# EAGLE design motor_drive_basic (EAGLE 8.6.2)
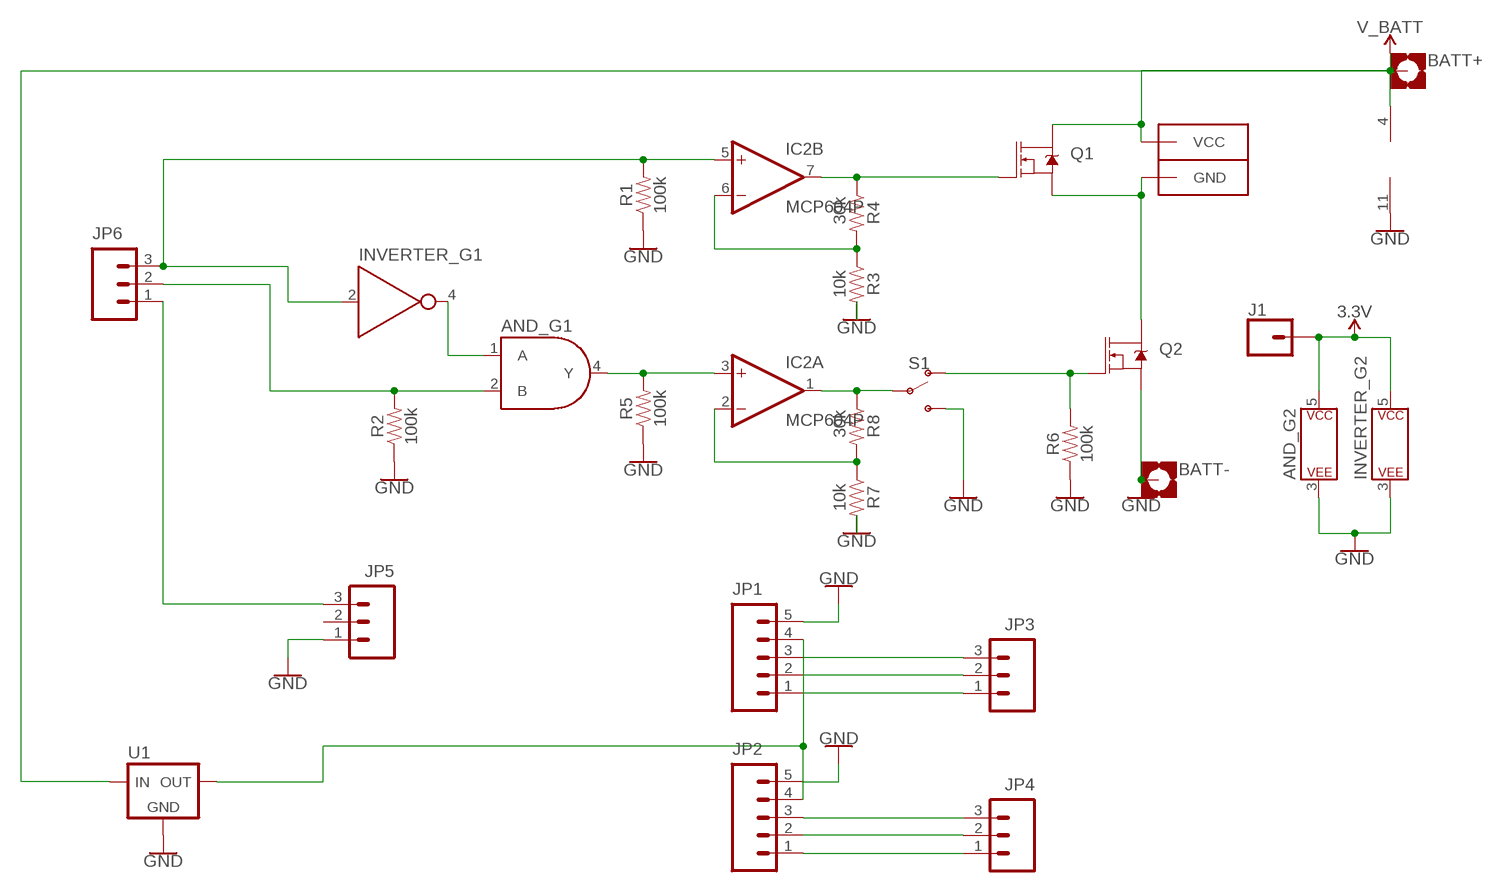
[diagram p0: schematic, sheet 1]

## Parts
AND_  74LVC08SE  [SOT23-5]
BATT+  MOUNT-PAD-SQUARE3.0  [3,0-PAD-SQUARE]
BATT-  MOUNT-PAD-SQUARE3.0  [3,0-PAD-SQUARE]
CONN1  ANDERSON_PP_DOUBLEVERTICAL  [ANDERSON_PP_DOUB_VERT]
IC2  MCP604P  [DIL14]
INVERTER_  74HC1G04  [SOT353]
J1  CONN_01  [1X01]
JP1  M05PTH  [1X05]
JP2  M05PTH  [1X05]
JP3  M03PTH  [1X03]
JP4  M03PTH  [1X03]
JP5  M03PTH  [1X03]
JP6  M03PTH  [1X03]
Q1  MOSFET-NCH-FQP30N06L  [TO220V]
Q2  MOSFET-NCH-FQP30N06L  [TO220V]
R1  100k  10KOHM-HORIZ-1/4W-1%  [AXIAL-0.3]
R2  100k  10KOHM-HORIZ-1/4W-1%  [AXIAL-0.3]
R3  10k  10KOHM-HORIZ-1/4W-1%  [AXIAL-0.3]
R4  30k  RESISTORAXIAL-0.3  [AXIAL-0.3]
R5  100k  10KOHM-HORIZ-1/4W-1%  [AXIAL-0.3]
R6  100k  10KOHM-HORIZ-1/4W-1%  [AXIAL-0.3]
R7  10k  10KOHM-HORIZ-1/4W-1%  [AXIAL-0.3]
R8  30k  RESISTORAXIAL-0.3  [AXIAL-0.3]
S1  SWITCH-SPDT-PTH-11.6X4.0MM-KIT  [SWITCH_SPDT_PTH_11.6X4.0MM_KIT]
U1  78XX-TO220V  [TO220BV]

## Nets
3.3V: AND_.5(P$V+) INVERTER_.5(P$V+) J1.1
GND: AND_.3(P$V-) BATT-.B3,0(MOUNT) IC2.11(P:V-) INVERTER_.3(P$V-) JP1.5 JP2.5 JP5.1 Q2.3(S) R1.P$1 R2.P$1 R3.P$2 R5.P$1 R6.P$1 R7.P$2 S1.3(S) U1.2(GND)
N$1: IC2.6(B:-IN) R3.P$1 R4.P$2
N$2: IC2.7(B:OUT) Q1.1(G) R4.P$1
N$3: IC2.2(A:-IN) R7.P$1 R8.P$2
N$4: AND_.4(Y) IC2.3(A:+IN) R5.P$2
N$5: Q2.1(G) R6.P$2 S1.1(O)
N$6: CONN1.PIN1(GND) Q1.3(S) Q2.2(D)
N$7: IC2.1(A:OUT) R8.P$1 S1.2(P)
N$8: AND_.1(A) INVERTER_.4(Y)
N$9: JP2.1 JP4.1
N$10: JP2.2 JP4.2
N$11: JP2.3 JP4.3
N$12: JP1.1 JP3.1
N$13: JP1.2 JP3.2
N$14: JP1.3 JP3.3
N$15: JP5.3 JP6.1
N$16: IC2.5(B:+IN) INVERTER_.2(A) JP6.3 R1.P$2
N$17: AND_.2(B) JP6.2 R2.P$2
N$18: JP1.4 JP2.4 U1.3(VOUT)
V_BATT: BATT+.B3,0(MOUNT) CONN1.PIN2(VCC) IC2.4(P:V+) Q1.2(D) U1.1(VIN)
Unconnected: IC2.8(C:OUT) IC2.9(C:-IN) IC2.10(C:+IN) IC2.12(D:+IN) IC2.13(D:-IN) IC2.14(D:OUT) JP5.2

## Library data of the parts
AND_ = SparkFun-IC-Logic:74*08: Single AND gate IC GATE AND SNGL 2INPUT SOT353 SparkFun Products SparkFun LogicBlocks Kit <https://www.sparkfun.com/products/11006> (KIT-11006) SparkFun RedBot Mainboard <https://www.sparkfun.com/products/12097> (ROB-12097); PROD_ID: IC-10841; VALUE: 74LVC1G08SE
BATT+ BATT- = holes:MOUNT-PAD-SQUARE: MOUNTING PAD, square
CONN1 = ee192:ANDERSON_PP_DOUBLE: 2-pin 25A Anderson Connector http://www.alliedelec.com/images/products/datasheets/bm/ANDERSON_POWER_PRODUCTS/70162018.pdf; PIE-INT-REF-NUM: Anderson
IC2 = linear:MCP604: Quad Op Amp 2.7V to 6.0V Single Supply CMOS Source: http://ww1.microchip.com/downloads/en/DeviceDoc/21314g.pdf
INVERTER_ = SparkFun-IC-Logic:74*1G04: Single Inverter IC NOT GATE INVERTER SNGL 1IN SOT353 Supply: 1.65V to 5.5V Datasheet <http://diodes.com/datasheets/74LVC1G04.pdf> SparkFun Products SparkFun Stepoko <https://www.sparkfun.com/products/13899> (ROB-13899) SparkFun CryptoShield <https://www.sparkfun.com/products/13183> (DEV-13183) SparkFun LogicBlocks Kit <https://www.sparkfun.com/products/11006> (KIT-11006) SparkFun ArduMoto <https://www.sparkfun.com/products/9815> (DEV-09815); PROD_ID: COMP-08268; VALUE: 74HC1G04
J1 = SparkFun-Connectors:CONN_01: Single connection point. Often used as Generic Header-pin footprint for 0.1 inch spaced/style header connections On any of the 0.1 inch spaced packages, you can populate with these: Break Away Headers - Straight <https://www.sparkfun.com/products/116> (PRT-00116) Break Away Male Headers - Right Angle <https://www.sparkfun.com/products/553> (PRT-00553) Female Headers <https://www.sparkfun.com/products/115> (PRT-00115) Break Away Headers - Machine Pin <https://www.sparkfun.com/products/117> (PRT-00117) Break Away Female Headers - Swiss Machine Pin <https://www.sparkfun.com/products/743> (PRT-00743) This device is also useful as a general connection point to wire up your design to another part of your project. Our various solder wires solder well into these plated through hole pads. Hook-Up Wire - Assortment (Stranded, 22 AWG) <https://www.sparkfun.com/products/11375> (PRT-11375) Hook-Up Wire - Assortment (Solid Core, 22 AWG) <https://www.sparkfun.com/products/11367> (PRT-11367) View the entire wire category on our website here <https://www.sparkfun.com/categories/141> Special notes: SMTSO-256-ET is a "flush mount" nut for a 4-40 screw. We mostly use this on specialty testbeds; it is a nice way to connect hardware to your PCB at an adjustable hieght. Also note, the SNAP packages are for using a snappable style connector. We sell a baggie of snaps and they are also used on two LilyPad designs: Snap Assortment - 30 pack (male and female) <https://www.sparkfun.com/products/11347> (DEV-11347) LilyPad Arduino SimpleSnap <https://www.sparkfun.com/products/10941> (DEV-10941) LilyPad SimpleSnap Protoboard <https://www.sparkfun.com/products/10940> (DEV-10940)
JP1 JP2 = ee192:M05: 5-pin 0.1-inch header and MTA connector Courtsey of Pioneers in Engineering; PIE-INT-REF-NUM: BULK-STOCK
JP3-JP6 = ee192:M03: 3-pin 0.1-inch header and MTA connector Courtsey of Pioneers in Engineering; PIE-INT-REF-NUM: BULK-STOCK
Q1 Q2 = SparkFun-DiscreteSemi:MOSFET-NCH: N-channel MOSFETs Voltage controlled devices that allow control of high current outputs. SparkFun Products: SparkFun OpenScale <https://www.sparkfun.com/products/13261> SparkFun Digital Sandbox <https://www.sparkfun.com/products/12651> SparkFun Monster Moto Shield <https://www.sparkfun.com/products/10182> SparkFun MOSFET Power Controller <https://www.sparkfun.com/products/11214>; PROD_ID: TRANS-10060; VALUE: 60V/32A/35mΩ
R1 R2 R5 R6 = SparkFun-Resistors:10KOHM: 10kΩ resistor A resistor is a passive two-terminal electrical component that implements electrical resistance as a circuit element. Resistors act to reduce current flow, and, at the same time, act to lower voltage levels within circuits. - Wikipedia; PROD_ID: RES-12183; VALUE: 10k
R3 R7 = SparkFun-Resistors:10KOHM: 10kΩ resistor A resistor is a passive two-terminal electrical component that implements electrical resistance as a circuit element. Resistors act to reduce current flow, and, at the same time, act to lower voltage levels within circuits. - Wikipedia; PROD_ID: RES-12183
R4 R8 = SparkFun-Resistors:RESISTOR: Generic Resistor Package
S1 = SparkFun-Switches:SWITCH-SPDT: Single Pole, Double Throw (SPDT) Switch Single-pole, double-throw (SPDT) switch. Variant Overview SMD-AYZ0202 Surface Mount DPDT Switch <https://www.sparkfun.com/products/597> (COM-00597) Used on e.g. LilyPad Arduino USB - ATmega32U4 Board <https://www.sparkfun.com/products/12049> PTH-11.6X4.0MM SPDT Mini Power Switch <https://www.sparkfun.com/products/102> (COM-00102) Used on e.g. SparkFun Simon Says - Through-Hole Soldering Kit <https://www.sparkfun.com/products/10547> (KIT-10547) PTH-11.6X4.0MM-KIT KIT version of SPDT Mini Power Switch - Simplifies soldering by removing tStop of switch pins - only one side can be soldered. PTH-11.6X4.0MM-LOCK LOCK version of SPDT Mini Power Switch - Offset pins hold switch in place for easier soldering. SMD-RIGHT-ANGLE Surface Mount Right Angle Switch <https://www.sparkfun.com/products/10860> (COM-10860) Used on e.g. SparkFun ESP8266 Thing <https://www.sparkfun.com/products/13231>; PROD_ID: SWCH-08261; SF_SKU: COM-00102
U1 = bt_regulator:78XX: 78XX Linear Voltage Regulator The venerable 7800-series Linear Voltage Regulator, including 7805, 7809, 7812, 7815, 7862 in 5 V, 6.2 V, 8.2 V, 9 V, 12 V, and 15 V, respectively Datasheets TI_LM78L05.pdf <http://www.ti.com/lit/ds/symlink/lm78l05.pdf> Fairchild_LM7805.pdf <https://www.fairchildsemi.com/datasheets/LM/LM7805.pdf>

## Board
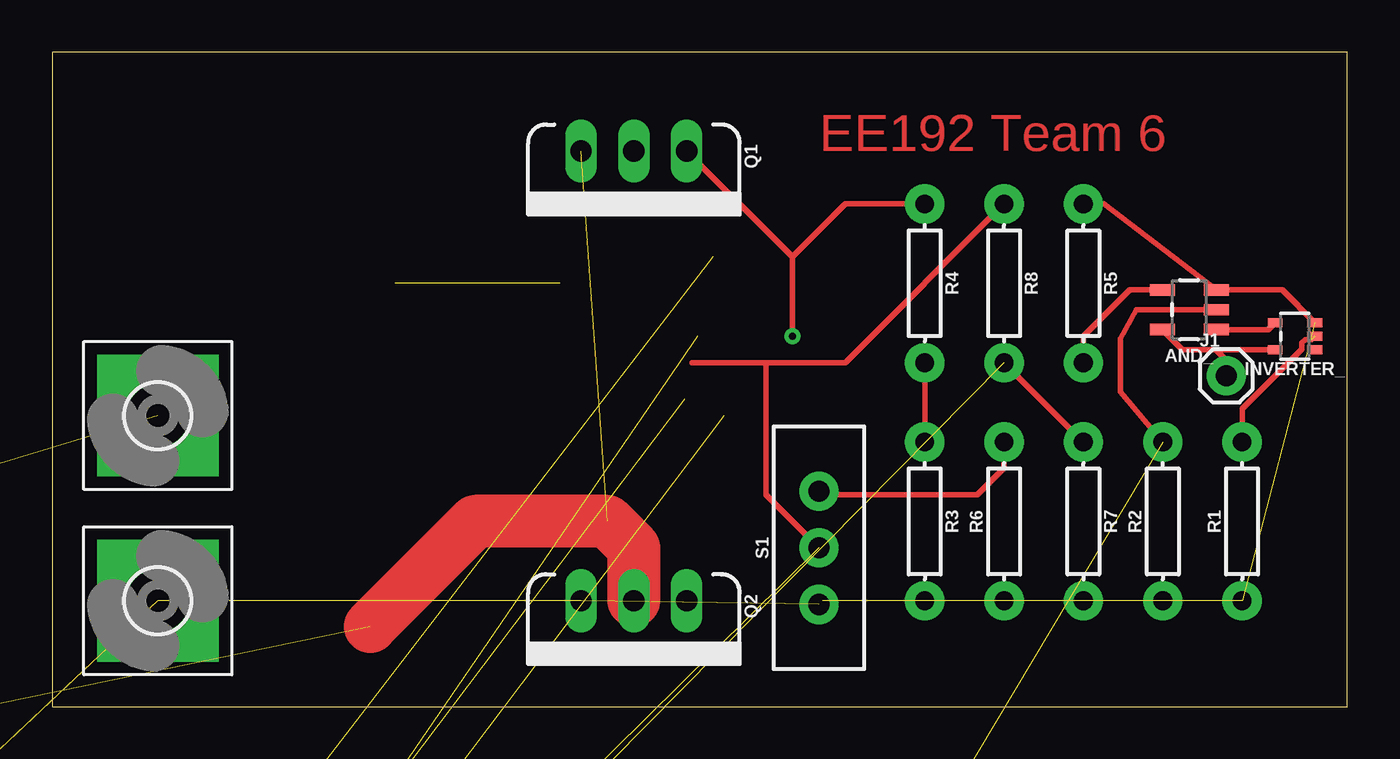
[diagram p1: board, top side]
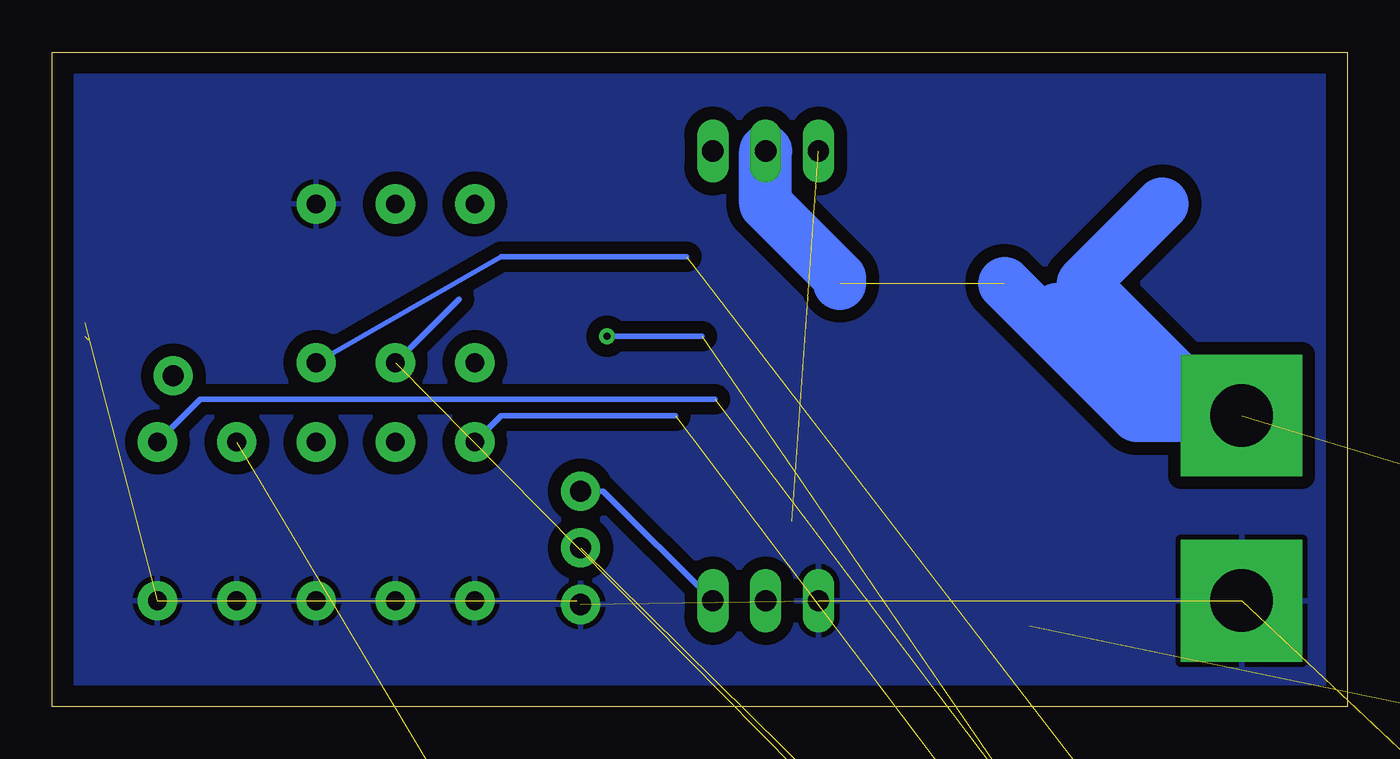
[diagram p2: board, bottom side, seen from below]

Size 62.21 x 31.42 mm. Coordinates in mm from the lower left corner, seen from the top.
Outline: 0,0 62.21,0 62.21,31.42 0,31.42 0,0
Copper layers (1*16): Top 0.035mm / dielectric 1.5mm / Bottom 0.035mm
Design rules "default": minimum track width 6mil, minimum drill 0.35mm, track to track 6mil, track to pad 6mil, pad to pad 6mil, via to via 6mil, smd to smd 6mil, copper to edge 40mil, drill to drill 6mil, minimum pad ring 10mil, minimum via ring 8mil, stop-mask expansion 4mil, vias tented up to drill 0mil, thermal gap 10mil

### Footprints (pad centres in the part's own frame; a part is rotated, then mirrored left to right if it is on the bottom)
SOT23-5 = smd 0.55 x 1.2: 1 -0.95,-1.3; 2 0,-1.3; 3 0.95,-1.3; 4 0.95,1.3; 5 -0.95,1.3
3,0-PAD-SQUARE = drill 3 pad 5.842 square: B3,0 0,0
ANDERSON_PP_DOUB_VERT = drill 1.778 pad 3.175: PIN1 0,-3.937; PIN2 0,3.937
DIL14 = drill 0.813 long: 1 -7.62,-3.81; 2 -5.08,-3.81; 3 -2.54,-3.81; 4 0,-3.81; 5 2.54,-3.81; 6 5.08,-3.81; 7 7.62,-3.81; 8 7.62,3.81; 9 5.08,3.81; 10 2.54,3.81; 11 0,3.81; 12 -2.54,3.81; 13 -5.08,3.81; 14 -7.62,3.81
SOT353 = smd 0.42 x 0.7: 1 -0.65,-0.95; 2 0,-0.95; 3 0.65,-0.95; 4 0.65,0.95; 5 -0.65,0.95
1X01 = drill 1.016 pad 1.88: 1 0,0
1X05 = drill 1.016 pad 1.88: 1 -5.08,0; 2 -2.54,0; 3 0,0; 4 2.54,0; 5 5.08,0
1X03 = drill 1.016 pad 1.88: 1 -2.54,0; 2 0,0; 3 2.54,0
TO220V = drill 1.016 long: 1 -2.54,0; 2 0,0; 3 2.54,0
AXIAL-0.3 = drill 0.9 pad 1.88: P$1 -3.81,0; P$2 3.81,0
SWITCH_SPDT_PTH_11.6X4.0MM_KIT = drill 1.016 pad 1.88: 1 0,2.718; 2 0,0; 3 0,-2.718
TO220BV = drill 1.016 long: 1 -2.54,0; 2 0,0; 3 2.54,0

### Placement (x,y rotation side)
AND_  54.61,19.05 90 top
BATT+  5.08,13.97 0 top
BATT-  5.08,5.08 0 top
CONN1  -40.64,-3.81 0 top  (outside the outline)
IC2  -41.91,-73.66 0 top  (outside the outline)
INVERTER_  59.69,17.78 90 top
J1  56.39,15.88 0 top
JP1  -41.91,-34.29 0 top  (outside the outline)
JP2  -41.91,-53.34 0 top  (outside the outline)
JP3  -44.45,-93.98 0 top  (outside the outline)
JP4  -44.45,-113.03 0 top  (outside the outline)
JP5  -44.45,-132.08 0 top  (outside the outline)
JP6  -44.45,-151.13 0 top  (outside the outline)
Q1  27.94,26.67 180 top
Q2  27.94,5.08 180 top
R1  57.15,8.89 90 top
R2  53.34,8.89 90 top
R3  41.91,8.89 270 top
R4  41.91,20.32 270 top
R5  49.53,20.32 270 top
R6  45.72,8.89 90 top
R7  49.53,8.89 270 top
R8  45.72,20.32 270 top
S1  36.83,7.62 0 top
U1  -45.72,-168.91 0 top  (outside the outline)

### Tracks (layer width: path | path; a pad name or v marks a point on that pad's centre or on a via)
3.3V
  Top 0.254: AND_.5 54.28,17.13 55.88,17.13 | 55.88,17.13 INVERTER_.5 | J1.1 56.39,16.62 55.88,17.13
GND  (13 unrouted)
  Top 0.254: INVERTER_.3 59.07,20 AND_.3 50.51,24.13 R5.P$1
  Bottom 0.254: S1.3 37.01,5.08
  pour Bottom (isolate 0.61): 0,31.75 0,0 62.23,0 62.23,31.75
N$1  (1 unrouted)
  Top 0.254: R4.P$2 R3.P$1
  Bottom 0.254: R3.P$1 40.64,13.97 32.26,13.97
N$2  (via drill 0.35)  (1 unrouted)
  Top 0.254: 35.56,21.59 Q1.1 | v35.56,17.78 35.56,21.59 | R4.P$1 38.1,24.13 35.56,21.59
  Bottom 0.254: 30.99,17.78 v35.56,17.78
N$3  (1 unrouted)
  Top 0.254: R7.P$1 R8.P$2
  Bottom 0.254: 42.67,19.56 R8.P$2
N$4  (1 unrouted)
  Top 0.254: R5.P$2 49.53,17.78 51.75,20 AND_.4
  Bottom 0.254: R5.P$2 40.64,21.59 31.75,21.59
N$5
  Top 0.254: R6.P$2 45.72,11.43 44.45,10.16 37.01,10.16 S1.1
  Bottom 0.254: Q2.1 35.74,10.34 S1.1
N$6  (2 unrouted)
  Top 2.54: 15.28,3.85 20.32,8.89 26.67,8.89 27.94,7.62 Q2.2
N$7  (1 unrouted)
  Top 0.254: R8.P$1 38.1,16.51 34.29,16.51 | 30.73,16.51 34.29,16.51 | S1.2 34.29,10.16 34.29,16.51
N$8
  Top 0.254: AND_.1 58.41,18.1 INVERTER_.4
N$9  (1 unrouted)
N$10  (1 unrouted)
N$11  (1 unrouted)
N$12  (1 unrouted)
N$13  (1 unrouted)
N$14  (1 unrouted)
N$15  (1 unrouted)
N$16  (3 unrouted)
  Top 0.254: 60.48,17.62 60.17,17.62 60.01,17.46 60.01,17.15 57.15,14.29 R1.P$2
  Bottom 0.254: 30.38,14.76 55.09,14.76 R1.P$2
N$17  (1 unrouted)
  Top 0.254: R2.P$2 51.31,15.11 51.31,17.65 52.07,19.05 AND_.2
N$18  (2 unrouted)
V_BATT  (4 unrouted)
  Bottom 2.54: 10.12,13.97 BATT+.B3,0 6.35,13.97 12.7,20.32 8.89,24.13 | 16.47,20.32 10.12,13.97 | 10.12,13.97 10.12,15.2 13.97,19.05 | 24.38,20.32 24.38,20.57 27.94,24.13 Q1.2

### Text on the board
Top: EE192 Team 6